# Altium schematic sheet STM8S003F3P6_RF433_315_LEARN_CODE_V1_0.SchDoc
size A4; SheetNumber: 1; SheetTotal: 1
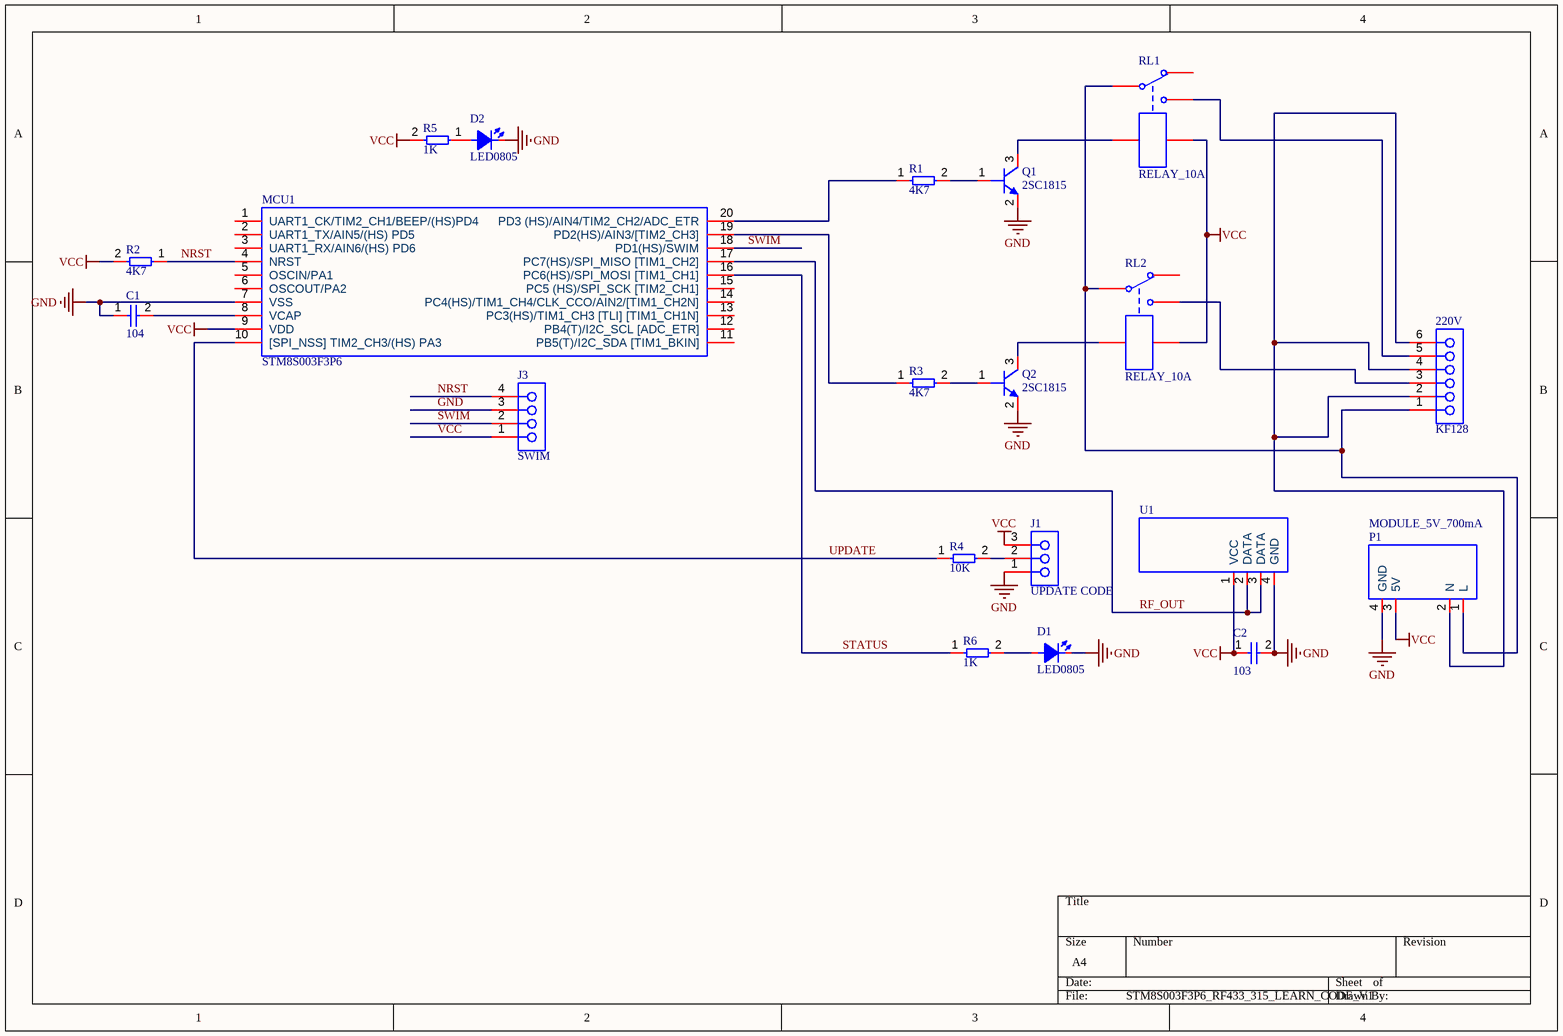
[diagram p0: STM8S003F3P6_RF433_315_LEARN_CODE_V1_0.SchDoc]

## Parts
220V  KF128  [HEADER_KF128_6_5.08MM]
C1  104  [C0805]
C2  103  [C0805]
D1  LED0805  [L0805RED]
D2  LED0805  [L0805RED]
J1  UPDATE CODE  [Header 3x1 TH Pitch 2.54mm]
J3  SWIM  [Header 4x1 TH Pitch 2.54mm]
MCU1  STM8S003F3P6  [TSSOP20_0.65_4.4]
P1  MODULE_5V_700mA  [MODULE_5V_700mA]
Q1  2SC1815  [SOT23-3]
Q2  2SC1815  [SOT23-3]
R1  4K7  [R0805]
R2  4K7  [R0805]
R3  4K7  [R0805]
R4  10K  [R0805]
R5  1K  [R0805]
R6  1K  [R0805]
RL1  RELAY_10A  [RELAY_10A_5PIN]
RL2  RELAY_10A  [RELAY_10A_5PIN]
U1  RF433_315_RECEVICE  [RF433_315_RECEVICE]  (value not drawn)

## Nets
GND: C1.1 C2.2 D1.2(K) D2.2(K) J1.1 J3.3 MCU1.7(VSS) P1.4(GND) Q1.2(E) Q2.2(E) U1.4(GND)
VCC: C2.1 J1.3 J3.1 MCU1.9(VDD) P1.3(5V) R2.2 R5.2 RL1.3 RL2.3 U1.1(VCC)
NRST: J3.4 MCU1.4(NRST) R2.1
RF_OUT: MCU1.17(PC7(HS)/SPI_MISO_[TIM1_CH2]) U1.2(DATA) U1.3(DATA)
STATUS: MCU1.16(PC6(HS)/SPI_MOSI_[TIM1_CH1]) R6.1
SWIM: J3.2 MCU1.18(PD1(HS)/SWIM)
UPDATE: MCU1.10([SPI_NSS]_TIM2_CH3/(HS)_PA3) R4.1
Net220V_1: 220V.1 P1.1(L) RL1.2 RL2.2
Net220V_2: 220V.2 220V.4 220V.6 P1.2(N)
Net220V_3: 220V.3 RL2.5
Net220V_5: 220V.5 RL1.5
NetC1_2: C1.2 MCU1.8(VCAP)
NetD1_1: D1.1(A) R6.2
NetD2_1: D2.1(A) R5.1
NetJ1_2: J1.2 R4.2
NetMCU1_19: MCU1.19(PD2(HS)/AIN3/[TIM2_CH3]) R3.1
NetMCU1_20: MCU1.20(PD3_(HS)/AIN4/TIM2_CH2/ADC_ETR) R1.1
NetQ1_1: Q1.1(B) R1.2
NetQ1_3: Q1.3(C) RL1.1
NetQ2_1: Q2.1(B) R3.2
NetQ2_3: Q2.3(C) RL2.1

Not connected (* = marked no-connect by the designer): MCU1 1(UART1_CK/TIM2_CH1/BEEP/(HS)PD4) 2(UART1_TX/AIN5/(HS)_PD5) 3(UART1_RX/AIN6/(HS)_PD6) 5(OSCIN/PA1) 6(OSCOUT/PA2) 11(PB5(T)/I2C_SDA_[TIM1_BKIN]) 12(PB4(T)/I2C_SCL_[ADC_ETR]) 13(PC3(HS)/TIM1_CH3_[TLI]_[TIM1_CH1N]) 14(PC4(HS)/TIM1_CH4/CLK_CCO/AIN2/[TIM1_CH2N]) 15(PC5_(HS)/SPI_SCK_[TIM2_CH1]); RL1 4; RL2 4

## Library data of the parts
220V = HEADER_KF128_6_5.08MM
C1 C2 = C0805
J1 = Header 3x1 TH Pitch 2.54mm
J3 = Header 4x1 TH Pitch 2.54mm
Q1 Q2 = 2SC1815 (SOT-23)
R1-R6 = Resistor SMD
U1 = RF433_315